# Altium schematic sheet Sheet1.SchDoc
size A2
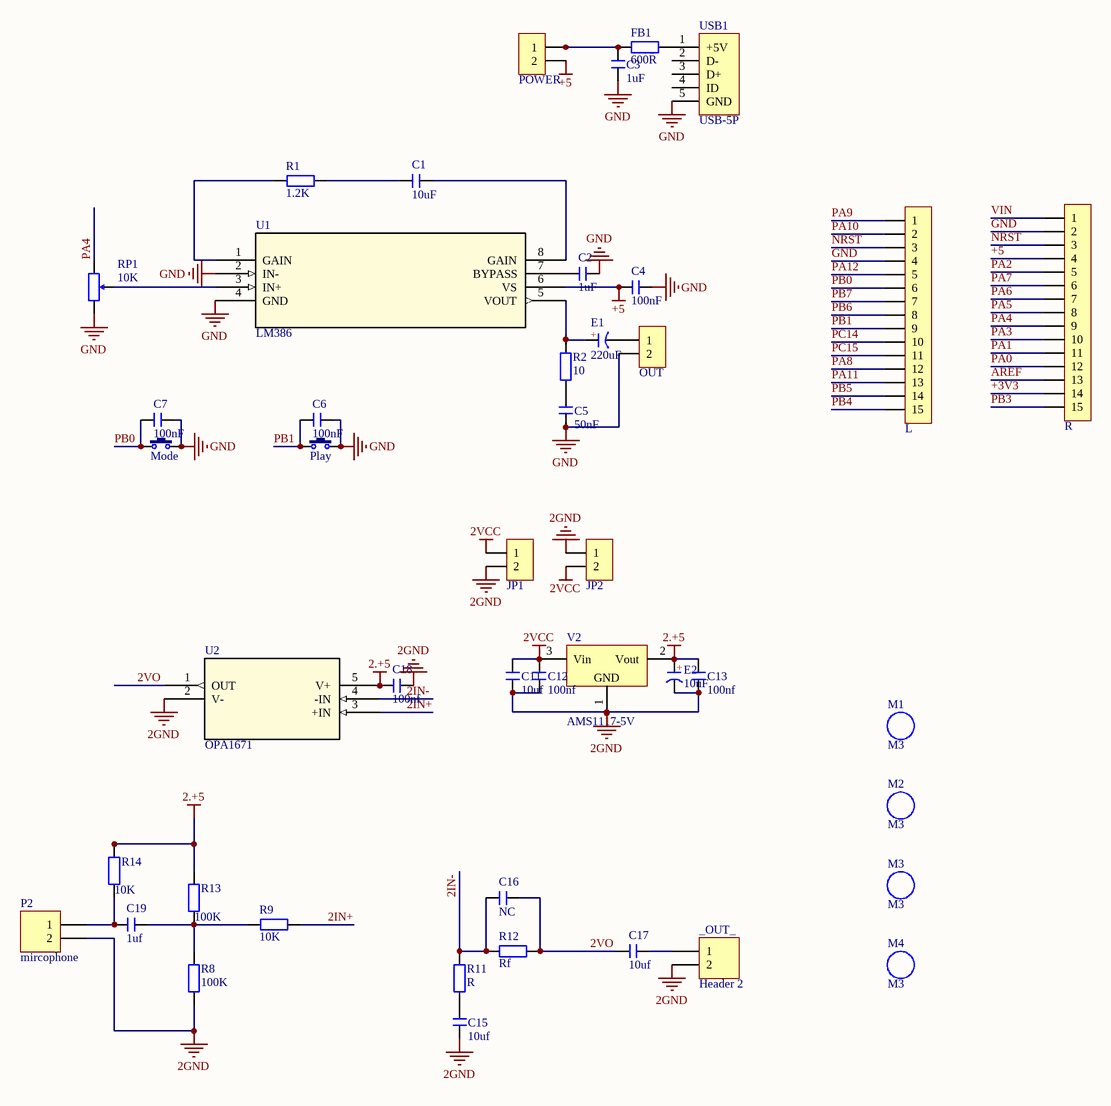
[diagram p0: Sheet1.SchDoc]

## Parts
_OUT_  Header 2  [HDR1X2]
C1  10uF  [C 0603_L]
C2  1uF  [C 0603_L]
C3  1uF  [C 0603_L]
C4  100nF  [C 0603_L]
C5  50nF  [C 0603_L]
C6  100nF  [C 0603_L]
C7  100nF  [C 0603_L]
C11  10uf  [C 0603_L]
C12  100nf  [C 0603_L]
C13  100nf  [C 0603_L]
C15  10uf  [C 0603_L]
C16  NC  [C 0603_L]
C17  10uf  [C 0603_L]
C18  100nf  [C 0603_L]
C19  1uf  [C 0603_L]
E1  220uF  [CAP 2.5*6.3*7]
E2  10uF  [CD B(3528)]
FB1  600R  [FB-0805]
JP1  HDR-1X2  [VH3.96-LI-2P]  (value not drawn)
JP2  HDR-1X2  [VH3.96-LI-2P]  (value not drawn)
L  HDR-1X15  [HDR2.54-LI-15P]  (value not drawn)
M1  M3  [M3 125X200]
M2  M3  [M3 125X200]
M3  M3  [M3 125X200]
M4  M3  [M3 125X200]
Mode  3x6x5  [TSW SMD-3*6*2.5]  (value not drawn)
OUT  HDR-1X2  [HDR2.54-LI-2P]  (value not drawn)
P2  mircophone  [HDR1X2]
Play  3x6x5  [TSW SMD-3*6*2.5]  (value not drawn)
POWER  HDR-1X2  [HDR2.54-LI-2P]  (value not drawn)
R  HDR-1X15  [HDR2.54-LI-15P]  (value not drawn)
R1  1.2K  [R 0603_L]
R2  10  [R 0603_L]
R8  100K  [R 0603_L]
R9  10K  [R 0603_L]
R11  R  [R 0603_L]
R12  Rf  [R 0603_L]
R13  100K  [R 0603_L]
R14  10K  [R 0603_L]
RP1  10K  [3296W]
U1  LM386  [SOP8_L]
U2  OPA1671  [SOT23-DBV5_TEX]
USB1  USB-5P  [USB-MINI-A]
V2  AMS1117-5V  [SOT223_L]

## Nets
2.+5: C13.2 C18.2 E2.1(A) R13.2 R14.2 U2.5(V+) V2.2(Vout)
2GND: _OUT_.2 C11.1 C12.1 C13.1 C15.1 C18.1 E2.2(K) JP1.2 JP2.1 P2.2 R8.1 U2.2(V-) V2.1(GND)
2VCC: C11.2 C12.2 JP1.1 JP2.2 V2.3(Vin)
+5: C4.2 POWER.2 R.4 U1.6(VS)
GND: C2.2 C3.1 C4.1 C5.2 C6.2 C7.2 L.4 Mode.2 OUT.2 Play.2 R.2 RP1.3 U1.2(IN-) U1.4(GND) USB1.5(GND)
2IN+: R9.2 U2.3(+IN)
2IN-: C16.2 R11.2 R12.2 U2.4(-IN)
2VO: C16.1 C17.2 R12.1 U2.1(OUT)
+3V3: R.14
AREF: R.13
NRST: L.3 R.3
PA0: R.12
PA1: R.11
PA2: R.5
PA3: R.10
PA4: R.9 RP1.1
PA5: R.8
PA6: R.7
PA7: R.6
PA8: L.12
PA9: L.1
PA10: L.2
PA11: L.13
PA12: L.5
PB0: C7.1 L.6 Mode.1
PB1: C6.1 L.9 Play.1
PB3: R.15
PB4: L.15
PB5: L.14
PB6: L.8
PB7: L.7
PC14: L.10
PC15: L.11
VIN: R.1
Net_OUT__1: _OUT_.1 C17.1
NetC1_1: C1.1 R1.2
NetC1_2: C1.2 U1.8(GAIN)
NetC2_1: C2.1 U1.7(BYPASS)
NetC3_2: C3.2 FB1.1 POWER.1
NetC5_1: C5.1 R2.1
NetC15_2: C15.2 R11.1
NetC19_1: C19.1 R8.2 R9.1 R13.1
NetC19_2: C19.2 P2.1 R14.1
NetE1_1: E1.1(A) R2.2 U1.5(VOUT)
NetE1_2: E1.2(K) OUT.1
NetFB1_2: FB1.2 USB1.1(+5V)
NetR1_1: R1.1 U1.1(GAIN)
NetRP1_2: RP1.2 U1.3(IN+)

Not connected (* = marked no-connect by the designer): USB1 2(D-) 3(D+) 4(ID)

## Notes on the sheet
- (in symbol C-CAP) +
- (in symbol C-CD) +

## Library data of the parts
_OUT_ P2 = Header 2: Header, 2-Pin; LatestRevisionDate: 17-Jul-2002; LatestRevisionNote: Re-released for DXP Platform.; Publisher: Altium Limited
C1-C7 C11-C13 C15-C19 = C: 无极性贴片电容; 版权归属: 源创客; BOM名称: 无极性贴片电容; 学习资源: www.ooocke.com
E1 = C-CAP: 直插电解电容; 版权归属: 源创客; BOM名称: 直插电解电容; 学习资源: www.ooocke.com
E2 = C-CD: 贴片钽电容; 版权归属: 源创客; BOM名称: 贴片钽电容; 学习资源: www.ooocke.com
FB1 = FB
JP1 JP2 = Header 2_1: 2P接插件; 版权归属: 源创客; BOM名称: 2P接插件; 学习资源: www.ooocke.com
L R = Header 15: 15P接插件; 版权归属: 源创客; BOM名称: 15P接插件; 学习资源: www.ooocke.com
M1-M4 = M3: 铜柱孔; 版权归属: 源创客; BOM名称: 铜柱孔; 学习资源: www.ooocke.com
Mode Play = TSW 3x6: 3x6轻触开关; 版权归属: 源创客; BOM名称: 3x6轻触开关; 学习资源: www.ooocke.com
OUT POWER = Header 2: 2P接插件; 版权归属: 源创客; BOM名称: 2P接插件; 学习资源: www.ooocke.com
R1 R2 R8 R9 R11-R14 = R: 贴片电阻; 版权归属: 源创客; BOM名称: 贴片电阻; 学习资源: www.ooocke.com
RP1 = RP-ID: 插件单联电位器; BOM名称: 插件电位器; 版权归属: 源创客; 学习资源: www.ooocke.com
U1 = LM386: 700mW音频功放; Mfr_Name: Texas Instruments; Manufacturer_Part_Number: LM386M-1/NOPB; Copyright: Copyright (C) 2021 Ultra Librarian. All rights reserved.; RefDes: RefDes; Type: DEV
U2 = OPA1671IDBVR: 低噪声音频运算放大器; Mfr_Name: Texas Instruments; Copyright: Copyright (C) 2021 Ultra Librarian. All rights reserved.; Manufacturer_Part_Number: OPA1671IDBVR; RefDes: RefDes; Type: DEV
USB1 = USB-5P: 微型USB母座; 版权归属: 源创客; BOM名称: 微型USB母座; 学习资源: www.ooocke.com
V2 = AMS1117: 三端稳压芯片; BOM名称: 稳压芯片; 版权归属: 源创客; 学习资源: www.ooocke.com